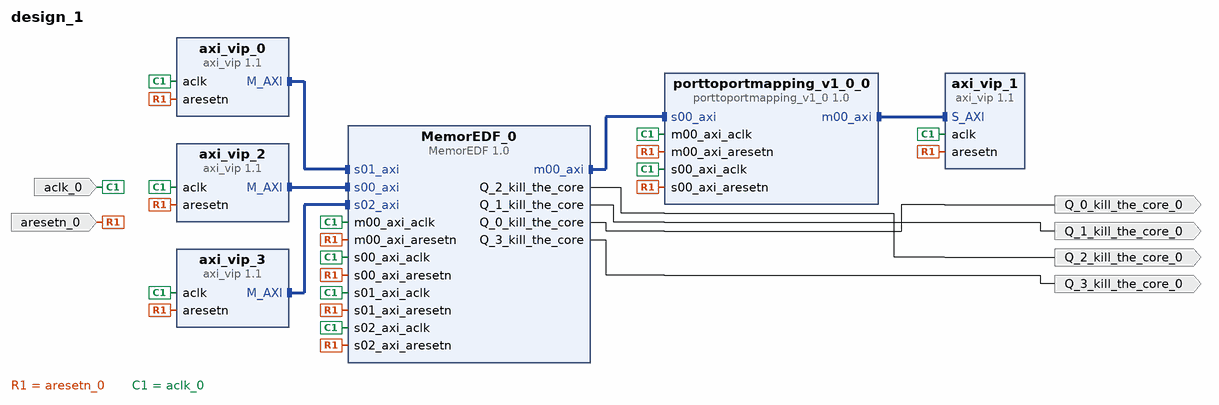
[diagram p0: block diagram of the top level]
# Vivado block design design_1, xczu9eg-ffvb1156-2-e, Vivado 2017.4
create_bd_design design_1

create_bd_port -dir I -type rst aresetn_0
create_bd_port -dir I -type clk aclk_0
create_bd_port -dir O Q_2_kill_the_core_0
create_bd_port -dir O Q_1_kill_the_core_0
create_bd_port -dir O Q_0_kill_the_core_0
create_bd_port -dir O Q_3_kill_the_core_0

create_bd_cell -type ip -vlnv xilinx.com:ip:axi_vip:1.1 axi_vip_0
set_property -dict [list \
  CONFIG.PROTOCOL AXI4 \
  CONFIG.READ_WRITE_MODE READ_WRITE \
  CONFIG.INTERFACE_MODE MASTER \
  CONFIG.ADDR_WIDTH 40 \
  CONFIG.DATA_WIDTH 128 \
  CONFIG.ID_WIDTH 16 \
  CONFIG.AWUSER_WIDTH 16 \
  CONFIG.ARUSER_WIDTH 16 \
  CONFIG.RUSER_WIDTH 0 \
  CONFIG.WUSER_WIDTH 0 \
  CONFIG.BUSER_WIDTH 0 \
  CONFIG.WUSER_BITS_PER_BYTE 0 \
  CONFIG.RUSER_BITS_PER_BYTE 0 \
  CONFIG.SUPPORTS_NARROW 1 \
  CONFIG.HAS_BURST 1 \
  CONFIG.HAS_LOCK 1 \
  CONFIG.HAS_CACHE 1 \
  CONFIG.HAS_REGION 1 \
  CONFIG.HAS_QOS 1 \
  CONFIG.HAS_PROT 1 \
  CONFIG.HAS_WSTRB 1 \
  CONFIG.HAS_BRESP 1 \
  CONFIG.HAS_RRESP 1 \
] [get_bd_cells axi_vip_0]
create_bd_cell -type ip -vlnv xilinx.com:ip:axi_vip:1.1 axi_vip_2
set_property -dict [list \
  CONFIG.PROTOCOL AXI4 \
  CONFIG.READ_WRITE_MODE READ_WRITE \
  CONFIG.INTERFACE_MODE MASTER \
  CONFIG.ADDR_WIDTH 40 \
  CONFIG.DATA_WIDTH 128 \
  CONFIG.ID_WIDTH 16 \
  CONFIG.AWUSER_WIDTH 16 \
  CONFIG.ARUSER_WIDTH 16 \
  CONFIG.RUSER_WIDTH 0 \
  CONFIG.WUSER_WIDTH 0 \
  CONFIG.BUSER_WIDTH 0 \
  CONFIG.WUSER_BITS_PER_BYTE 0 \
  CONFIG.RUSER_BITS_PER_BYTE 0 \
  CONFIG.SUPPORTS_NARROW 1 \
  CONFIG.HAS_BURST 1 \
  CONFIG.HAS_LOCK 1 \
  CONFIG.HAS_CACHE 1 \
  CONFIG.HAS_REGION 1 \
  CONFIG.HAS_QOS 1 \
  CONFIG.HAS_PROT 1 \
  CONFIG.HAS_WSTRB 1 \
  CONFIG.HAS_BRESP 1 \
  CONFIG.HAS_RRESP 1 \
] [get_bd_cells axi_vip_2]
create_bd_cell -type ip -vlnv xilinx.com:ip:axi_vip:1.1 axi_vip_1
set_property -dict {CONFIG.INTERFACE_MODE SLAVE CONFIG.ADDR_WIDTH 40 CONFIG.DATA_WIDTH 128} [get_bd_cells axi_vip_1]
create_bd_cell -type ip -vlnv xilinx.com:ip:axi_vip:1.1 axi_vip_3
set_property -dict [list \
  CONFIG.PROTOCOL AXI4 \
  CONFIG.READ_WRITE_MODE READ_WRITE \
  CONFIG.INTERFACE_MODE MASTER \
  CONFIG.ADDR_WIDTH 40 \
  CONFIG.DATA_WIDTH 128 \
  CONFIG.ID_WIDTH 16 \
  CONFIG.AWUSER_WIDTH 16 \
  CONFIG.ARUSER_WIDTH 16 \
  CONFIG.RUSER_WIDTH 0 \
  CONFIG.WUSER_WIDTH 0 \
  CONFIG.BUSER_WIDTH 0 \
  CONFIG.WUSER_BITS_PER_BYTE 0 \
  CONFIG.RUSER_BITS_PER_BYTE 0 \
  CONFIG.SUPPORTS_NARROW 1 \
  CONFIG.HAS_BURST 1 \
  CONFIG.HAS_LOCK 1 \
  CONFIG.HAS_CACHE 1 \
  CONFIG.HAS_REGION 1 \
  CONFIG.HAS_QOS 1 \
  CONFIG.HAS_PROT 1 \
  CONFIG.HAS_WSTRB 1 \
  CONFIG.HAS_BRESP 1 \
  CONFIG.HAS_RRESP 1 \
] [get_bd_cells axi_vip_3]
create_bd_cell -type ip -vlnv user.org:user:porttoportmapping_v1_0:1.0 porttoportmapping_v1_0_0
set_property -dict {CONFIG.C_M00_AXI_ID_WIDTH 16} [get_bd_cells porttoportmapping_v1_0_0]
create_bd_cell -type ip -vlnv user.org:user:MemorEDF:1.0 MemorEDF_0
set_property -dict [list \
  CONFIG.CONFIGURATION_PORT_ENABLED true \
  CONFIG.DATA_SIZE 678 \
  CONFIG.TDMA_ENABLED true \
  CONFIG.EDF_ENABLED true \
  CONFIG.C_S00_AXI_ID_WIDTH 16 \
  CONFIG.C_S00_AXI_DATA_WIDTH 128 \
  CONFIG.C_S00_AXI_ADDR_WIDTH 40 \
  CONFIG.C_S01_AXI_ID_WIDTH 16 \
  CONFIG.C_S01_AXI_DATA_WIDTH 128 \
  CONFIG.C_S01_AXI_ADDR_WIDTH 40 \
  CONFIG.C_S01_AXI_AWUSER_WIDTH 16 \
  CONFIG.C_S01_AXI_ARUSER_WIDTH 16 \
  CONFIG.C_M00_AXI_ID_WIDTH 16 \
  CONFIG.C_M00_AXI_ADDR_WIDTH 40 \
  CONFIG.C_M00_AXI_DATA_WIDTH 128 \
] [get_bd_cells MemorEDF_0]

# ---- connections ----

connect_bd_intf_net [get_bd_intf_pins MemorEDF_0/s01_axi] [get_bd_intf_pins axi_vip_0/M_AXI]
connect_bd_intf_net [get_bd_intf_pins axi_vip_2/M_AXI] [get_bd_intf_pins MemorEDF_0/s00_axi]
connect_bd_intf_net [get_bd_intf_pins axi_vip_3/M_AXI] [get_bd_intf_pins MemorEDF_0/s02_axi]
connect_bd_intf_net [get_bd_intf_pins MemorEDF_0/m00_axi] [get_bd_intf_pins porttoportmapping_v1_0_0/s00_axi]
connect_bd_intf_net [get_bd_intf_pins porttoportmapping_v1_0_0/m00_axi] [get_bd_intf_pins axi_vip_1/S_AXI]
connect_bd_net -net aresetn_0_1 [get_bd_ports aresetn_0] \
  [get_bd_pins axi_vip_0/aresetn] [get_bd_pins axi_vip_2/aresetn] [get_bd_pins axi_vip_1/aresetn] \
  [get_bd_pins axi_vip_3/aresetn] [get_bd_pins porttoportmapping_v1_0_0/s00_axi_aresetn] \
  [get_bd_pins porttoportmapping_v1_0_0/m00_axi_aresetn] [get_bd_pins MemorEDF_0/s00_axi_aresetn] \
  [get_bd_pins MemorEDF_0/s01_axi_aresetn] [get_bd_pins MemorEDF_0/s02_axi_aresetn] [get_bd_pins MemorEDF_0/m00_axi_aresetn]
connect_bd_net -net aclk_0_1 [get_bd_ports aclk_0] \
  [get_bd_pins axi_vip_0/aclk] [get_bd_pins axi_vip_2/aclk] [get_bd_pins axi_vip_1/aclk] [get_bd_pins axi_vip_3/aclk] \
  [get_bd_pins porttoportmapping_v1_0_0/s00_axi_aclk] [get_bd_pins porttoportmapping_v1_0_0/m00_axi_aclk] \
  [get_bd_pins MemorEDF_0/s00_axi_aclk] [get_bd_pins MemorEDF_0/s01_axi_aclk] [get_bd_pins MemorEDF_0/s02_axi_aclk] \
  [get_bd_pins MemorEDF_0/m00_axi_aclk]
connect_bd_net [get_bd_pins MemorEDF_0/Q_2_kill_the_core] [get_bd_ports Q_2_kill_the_core_0]
connect_bd_net [get_bd_pins MemorEDF_0/Q_1_kill_the_core] [get_bd_ports Q_1_kill_the_core_0]
connect_bd_net [get_bd_pins MemorEDF_0/Q_0_kill_the_core] [get_bd_ports Q_0_kill_the_core_0]
connect_bd_net [get_bd_pins MemorEDF_0/Q_3_kill_the_core] [get_bd_ports Q_3_kill_the_core_0]

# ---- address map ----
assign_bd_address -offset 0x0044A00000 -range 64K -target_address_space [get_bd_addr_spaces axi_vip_0/Master_AXI] [get_bd_addr_segs MemorEDF_0/s01_axi/Reg]

validate_bd_design
save_bd_design
